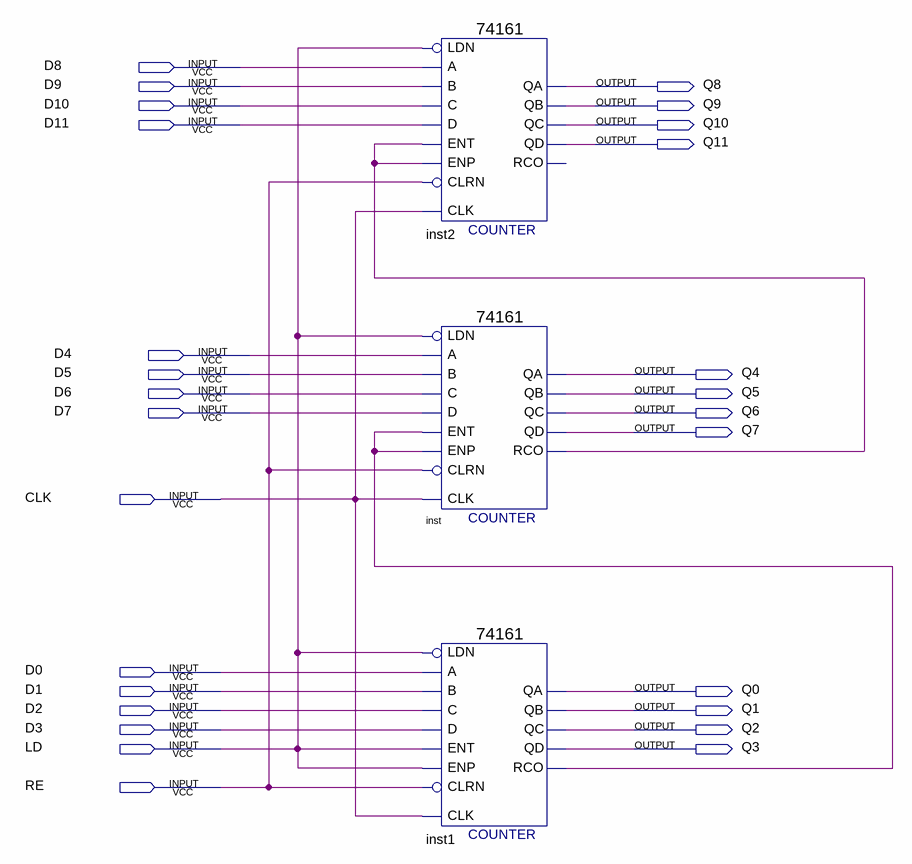
[diagram p0: schematic sheet]
// Quartus schematic upc.bdf as structural Verilog: 3 symbols, 27 pins
module upc (
  input  D8,
  input  D9,
  input  D10,
  input  D11,
  input  D4,
  input  D5,
  input  D6,
  input  D7,
  input  CLK,
  input  D0,
  input  D1,
  input  D2,
  input  D3,
  input  LD,
  input  RE,
  output Q8,
  output Q9,
  output Q10,
  output Q11,
  output Q4,
  output Q5,
  output Q6,
  output Q7,
  output Q0,
  output Q1,
  output Q2,
  output Q3
);

  wire inst1_rco, inst_rco;

  \74161  inst2 (
    .CLRN(RE), .CLK(CLK), .ENP(inst_rco), .LDN(LD), .A(D8), .D(D11), .ENT(inst_rco), .B(D9), .C(D10),
    .QD(Q11), .QC(Q10), .QB(Q9), .QA(Q8));  // open: RCO
  \74161  inst (
    .CLRN(RE), .CLK(CLK), .ENP(inst1_rco), .LDN(LD), .A(D4), .D(D7), .ENT(inst1_rco), .B(D5), .C(D6),
    .QD(Q7), .QC(Q6), .QB(Q5), .QA(Q4), .RCO(inst_rco));
  \74161  inst1 (
    .CLRN(RE), .CLK(CLK), .ENP(LD), .LDN(LD), .A(D0), .D(D3), .ENT(LD), .B(D1), .C(D2), .QD(Q3), .QC(Q2),
    .QB(Q1), .QA(Q0), .RCO(inst1_rco));
endmodule
